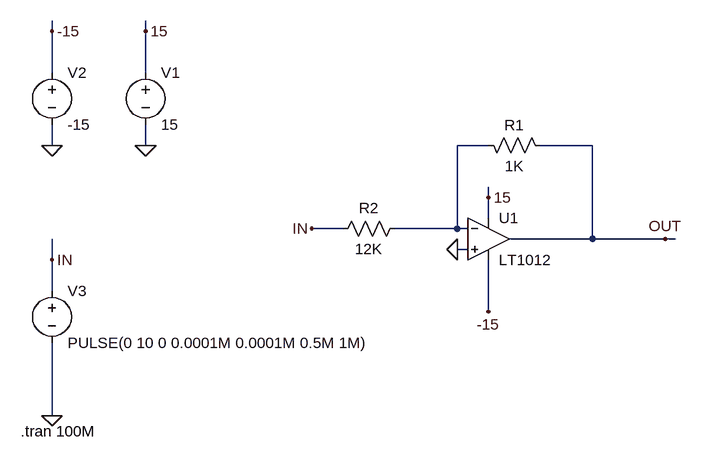
[diagram p0: schematic TriggerSchmidt.asc]
TriggerSchmidt.asc, the LTspice schematic file:
Version 4
SHEET 1 880 680
WIRE -272 -304 -272 -320
WIRE -128 -304 -128 -320
WIRE -272 -240 -272 -304
WIRE -128 -240 -128 -304
WIRE -272 -128 -272 -160
WIRE -128 -128 -128 -160
WIRE 400 -128 352 -128
WIRE 560 -128 480 -128
WIRE 400 -48 400 -64
WIRE 400 -16 400 -48
WIRE 176 0 128 0
WIRE 352 0 352 -128
WIRE 352 0 256 0
WIRE 368 0 352 0
WIRE 560 16 560 -128
WIRE 560 16 432 16
WIRE 672 16 560 16
WIRE 688 16 672 16
WIRE 368 32 352 32
WIRE -272 48 -272 16
WIRE -272 96 -272 48
WIRE 400 128 400 48
WIRE -272 288 -272 176
FLAG 128 0 IN
FLAG -128 -128 0
FLAG -272 -128 0
FLAG -128 -304 15
FLAG -272 -304 -15
FLAG -272 288 0
FLAG -272 48 IN
FLAG 352 32 0
FLAG 672 16 OUT
FLAG 400 -48 15
FLAG 400 128 -15
SYMBOL voltage -128 -256 R0
WINDOW 123 0 0 Left 2
WINDOW 39 0 0 Left 2
SYMATTR InstName V1
SYMATTR Value 15
SYMBOL voltage -272 -256 R0
WINDOW 123 0 0 Left 2
WINDOW 39 0 0 Left 2
SYMATTR InstName V2
SYMATTR Value -15
SYMBOL voltage -272 80 R0
WINDOW 123 0 0 Left 2
WINDOW 39 0 0 Left 2
SYMATTR InstName V3
SYMATTR Value PULSE(0 10 0 0.0001M 0.0001M 0.5M 1M)
SYMBOL res 272 -16 R90
WINDOW 0 0 56 VBottom 2
WINDOW 3 32 56 VTop 2
SYMATTR InstName R2
SYMATTR Value 12K
SYMBOL Opamps\\LT1012 400 -48 R0
SYMATTR InstName U1
SYMBOL res 384 -144 M90
WINDOW 0 0 56 VBottom 2
WINDOW 3 32 56 VTop 2
SYMATTR InstName R1
SYMATTR Value 1K
TEXT -320 312 Left 2 !.tran 100M

The netlist it stands for:
* TriggerSchmidt.asc
V1 15 0 15
V2 -15 0 -15
V3 IN 0 PULSE(0 10 0 0.0001M 0.0001M 0.5M 1M)
R2 N001 IN 12K
XU1 0 N001 15 -15 OUT LT1012  ; pins In+ In- V+ V- OUT
R1 N001 OUT 1K
.tran 100M
.backanno
.end